# EAGLE schematic Power Supply (EAGLE 8.6.0)
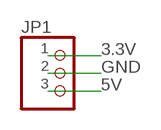
[diagram p0: schematic, sheet 1]

## Parts
JP1  PINHD-1X3  [1X03]

## Nets
3.3V: JP1.1
5V: JP1.3
GND: JP1.2

## Library data of the parts
JP1 = PinHead+:PINHD-1X3: PIN HEADER